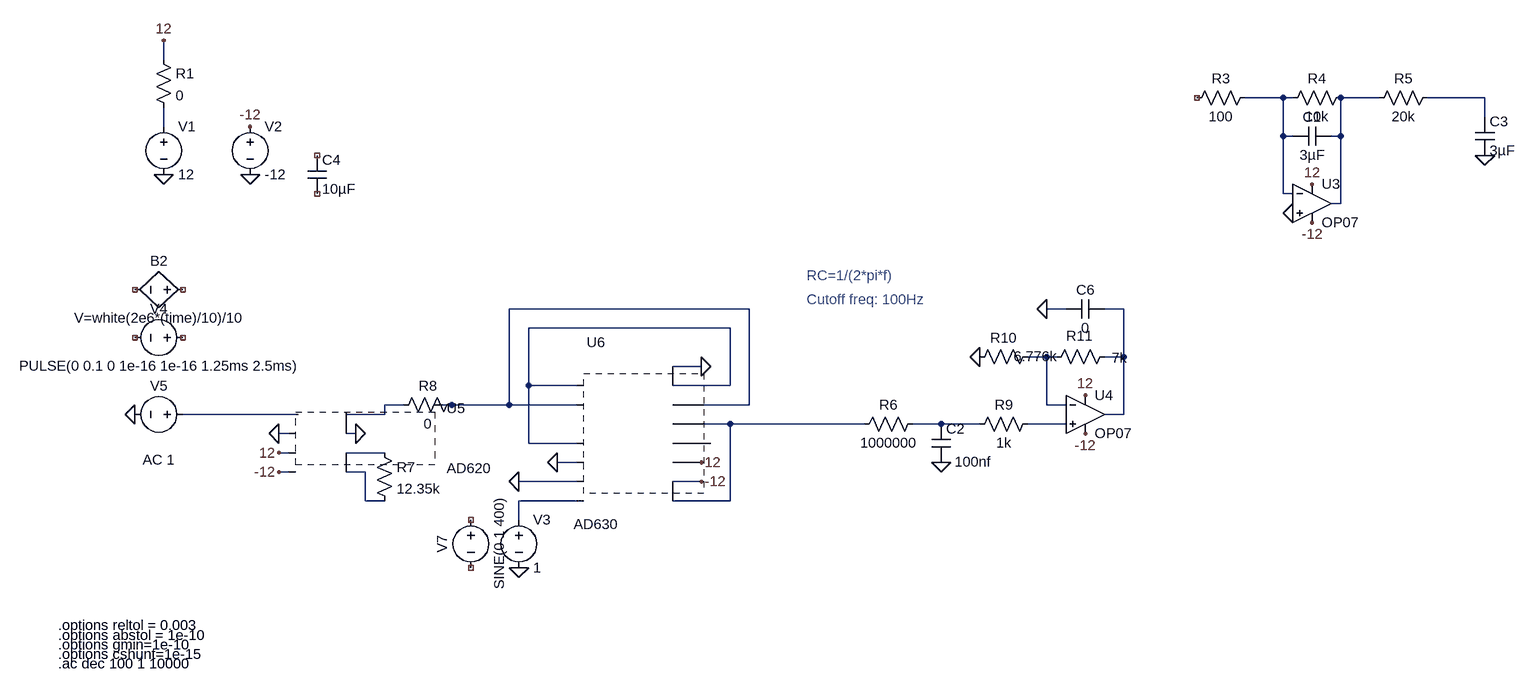
[diagram p0: schematic sensor circuit.asc]
sensor circuit.asc, the LTspice schematic file:
Version 4
SHEET 1 3080 1104
WIRE -128 80 -128 48
WIRE 2528 144 2464 144
WIRE 2544 144 2528 144
WIRE 2688 144 2624 144
WIRE 2864 144 2768 144
WIRE 2864 176 2864 144
WIRE -128 192 -128 160
WIRE 2528 208 2528 144
WIRE 2544 208 2528 208
WIRE 2624 208 2624 144
WIRE 2624 208 2608 208
WIRE 2528 304 2528 208
WIRE 2544 304 2528 304
WIRE 2624 320 2624 208
WIRE 2624 320 2608 320
WIRE 848 496 448 496
WIRE 1376 496 1344 496
WIRE 1472 496 1440 496
WIRE 816 528 480 528
WIRE 1344 576 1312 576
WIRE 1360 576 1344 576
WIRE 1472 576 1472 496
WIRE 1472 576 1440 576
WIRE 768 592 720 592
WIRE 480 624 480 528
WIRE 560 624 480 624
WIRE 816 624 816 528
WIRE 816 624 720 624
WIRE 272 656 240 656
WIRE 352 656 336 656
WIRE 448 656 448 496
WIRE 448 656 352 656
WIRE 560 656 448 656
WIRE 848 656 848 496
WIRE 848 656 720 656
WIRE 1344 656 1344 576
WIRE 1376 656 1344 656
WIRE 80 672 -96 672
WIRE 96 672 80 672
WIRE 240 672 240 656
WIRE 240 672 176 672
WIRE 1472 672 1472 576
WIRE 1472 672 1440 672
WIRE 816 688 720 688
WIRE 1040 688 816 688
WIRE 1168 688 1120 688
WIRE 1232 688 1168 688
WIRE 1376 688 1312 688
WIRE 80 704 64 704
WIRE 192 704 176 704
WIRE 480 720 480 624
WIRE 560 720 480 720
WIRE 784 720 720 720
WIRE 80 736 64 736
WIRE 240 736 176 736
WIRE 560 752 528 752
WIRE 768 752 720 752
WIRE 80 768 64 768
WIRE 208 768 176 768
WIRE 560 784 464 784
WIRE 768 784 720 784
WIRE 208 816 208 768
WIRE 240 816 208 816
WIRE 560 816 464 816
WIRE 816 816 816 688
WIRE 816 816 720 816
WIRE 464 848 464 816
FLAG -128 272 0
FLAG -128 48 12
FLAG 1168 752 0
FLAG 1408 704 -12
FLAG 1408 640 12
FLAG 2576 288 12
FLAG 2576 352 -12
FLAG 2544 336 0
FLAG 2864 240 0
FLAG 64 768 -12
FLAG 64 736 12
FLAG 192 704 0
FLAG -176 672 0
FLAG 64 704 0
FLAG 528 752 0
FLAG 768 592 0
FLAG 768 752 12
FLAG 768 784 -12
FLAG 464 928 0
FLAG 464 784 0
FLAG 16 272 0
FLAG 16 192 -12
FLAG 1232 576 0
FLAG 1344 496 0
SYMBOL voltage -128 176 R0
WINDOW 123 0 0 Left 0
WINDOW 39 0 0 Left 0
SYMATTR InstName V1
SYMATTR Value 12
SYMBOL bv -80 464 R90
WINDOW 0 -32 56 VBottom 2
WINDOW 3 32 56 VTop 2
SYMATTR InstName B2
SYMATTR Value V=white(2e6*(time)/10)/10
SYMBOL res 1328 672 R90
WINDOW 0 0 56 VBottom 2
WINDOW 3 32 56 VTop 2
SYMATTR InstName R9
SYMATTR Value 1k
SYMBOL cap 1152 688 R0
WINDOW 3 38 63 Left 2
SYMATTR Value 100nf
SYMATTR InstName C2
SYMBOL OpAmps\\OP07 1408 608 R0
SYMATTR InstName U4
SYMBOL res 1328 560 R90
WINDOW 0 0 56 VBottom 2
WINDOW 3 0 3 VTop 2
SYMATTR InstName R10
SYMATTR Value 6.776k
SYMBOL res 1456 560 R90
WINDOW 0 -3 58 VBottom 2
WINDOW 3 2 -9 VTop 2
SYMATTR InstName R11
SYMATTR Value 7k
SYMBOL res 2480 128 R90
WINDOW 0 0 56 VBottom 2
WINDOW 3 32 56 VTop 2
SYMATTR InstName R3
SYMATTR Value 100
SYMBOL res 2640 128 R90
WINDOW 0 0 56 VBottom 2
WINDOW 3 32 56 VTop 2
SYMATTR InstName R4
SYMATTR Value 10k
SYMBOL cap 2608 192 R90
WINDOW 0 0 32 VBottom 2
WINDOW 3 32 32 VTop 2
SYMATTR InstName C1
SYMATTR Value 3µF
SYMBOL res 2784 128 R90
WINDOW 0 0 56 VBottom 2
WINDOW 3 32 56 VTop 2
SYMATTR InstName R5
SYMATTR Value 20k
SYMBOL cap 2848 176 R0
SYMATTR InstName C3
SYMATTR Value 3µF
SYMBOL OpAmps\\OP07 2576 256 R0
SYMATTR InstName U3
SYMBOL res 1136 672 R90
WINDOW 0 0 56 VBottom 2
WINDOW 3 32 56 VTop 2
SYMATTR InstName R6
SYMATTR Value 1000000
SYMBOL AutoGenerated\\AD620 128 720 R0
SYMATTR InstName U5
SYMBOL res 224 720 R0
SYMATTR InstName R7
SYMATTR Value 12.35k
SYMBOL voltage -80 544 R90
WINDOW 0 -32 56 VBottom 2
WINDOW 3 32 56 VTop 2
WINDOW 123 0 0 Left 0
WINDOW 39 0 0 Left 0
SYMATTR InstName V4
SYMATTR Value PULSE(0 0.1 0 1e-16 1e-16 1.25ms 2.5ms)
SYMBOL voltage 384 832 R0
WINDOW 0 -32 56 VBottom 2
WINDOW 3 32 56 VTop 2
WINDOW 123 0 0 Left 0
WINDOW 39 0 0 Left 0
SYMATTR InstName V7
SYMATTR Value SINE(0 1 400)
SYMBOL res 368 640 R90
WINDOW 0 0 56 VBottom 2
WINDOW 3 32 56 VTop 2
SYMATTR InstName R8
SYMATTR Value 0
SYMBOL AutoGenerated\\AD630 592 704 R0
WINDOW 0 0 -136 Bottom 2
WINDOW 3 0 136 Top 2
SYMATTR InstName U6
SYMBOL cap 112 240 R0
SYMATTR InstName C4
SYMATTR Value 10µF
SYMBOL voltage 16 176 R0
WINDOW 123 0 0 Left 0
WINDOW 39 0 0 Left 0
SYMATTR InstName V2
SYMATTR Value -12
SYMBOL cap 1440 480 R90
WINDOW 0 0 32 VBottom 2
WINDOW 3 32 32 VTop 2
SYMATTR InstName C6
SYMATTR Value 0
SYMBOL res -144 64 R0
SYMATTR InstName R1
SYMATTR Value 0
SYMBOL voltage 464 832 R0
WINDOW 123 0 0 Left 0
WINDOW 39 0 0 Left 0
SYMATTR InstName V3
SYMATTR Value 1
SYMBOL voltage -80 672 R90
WINDOW 0 -32 56 VBottom 2
WINDOW 3 32 56 VTop 2
WINDOW 123 60 56 VTop 2
WINDOW 39 0 0 Left 0
SYMATTR InstName V5
SYMATTR Value ""
SYMATTR Value2 AC 1
TEXT -304 1072 Left 2 !.options cshunt=1e-15
TEXT -304 1088 Left 2 !.ac dec 100 1 10000
TEXT -304 1056 Left 2 !.options gmin=1e-10
TEXT -304 1040 Left 2 !.options abstol = 1e-10
TEXT -304 1024 Left 2 !.options reltol = 0.003
TEXT 944 440 Left 2 ;RC=1/(2*pi*f)
TEXT 944 480 Left 2 ;Cutoff freq: 100Hz

The netlist it stands for:
* sensor circuit.asc
V1 N004 0 12
B2 NC_01 NC_02 V=white(2e6*(time)/10)/10
R9 N013 N012 1k
C2 N012 0 100nf
XU4 N013 N008 12 -12 N006 LT1001  ; OP07, pins In+ In- V+ V- OUT
R10 N008 0 6.776k
R11 N006 N008 7k
R3 N001 NC_03 100
R4 N002 N001 10k
C1 N002 N001 3µF
R5 N003 N002 20k
C3 N003 0 3µF
XU3 0 N001 12 -12 N002 LT1001  ; OP07, pins In+ In- V+ V- OUT
R6 N012 N011 1000000
* U5: AD620 (symbol AutoGenerated\AD620 not available, pin order unknown); nets seen at it: -12, 0, 12, N005, N009, N010, N015, N016
R7 N015 N016 12.35k
V4 NC_04 NC_05 PULSE(0 0.1 0 1e-16 1e-16 1.25ms 2.5ms)
V7 NC_06 NC_07 SINE(0 1 400)
R8 N005 N009 0
* U6: AD630 (symbol AutoGenerated\AD630 not available, pin order unknown); nets seen at it: -12, 0, 12, N005, N007, N011, N014, N017
C4 NC_08 NC_09 10µF
V2 -12 0 -12
C6 N006 0 0
R1 12 N004 0
V3 N017 0 1
V5 N010 0 AC 1
.options cshunt=1e-15
.ac dec 100 1 10000
.options gmin=1e-10
.options abstol = 1e-10
.options reltol = 0.003
* RC=1/(2*pi*f)
* Cutoff freq: 100Hz
.lib LTC.lib
.backanno
.end